# Altium project kea once.PrjPCB
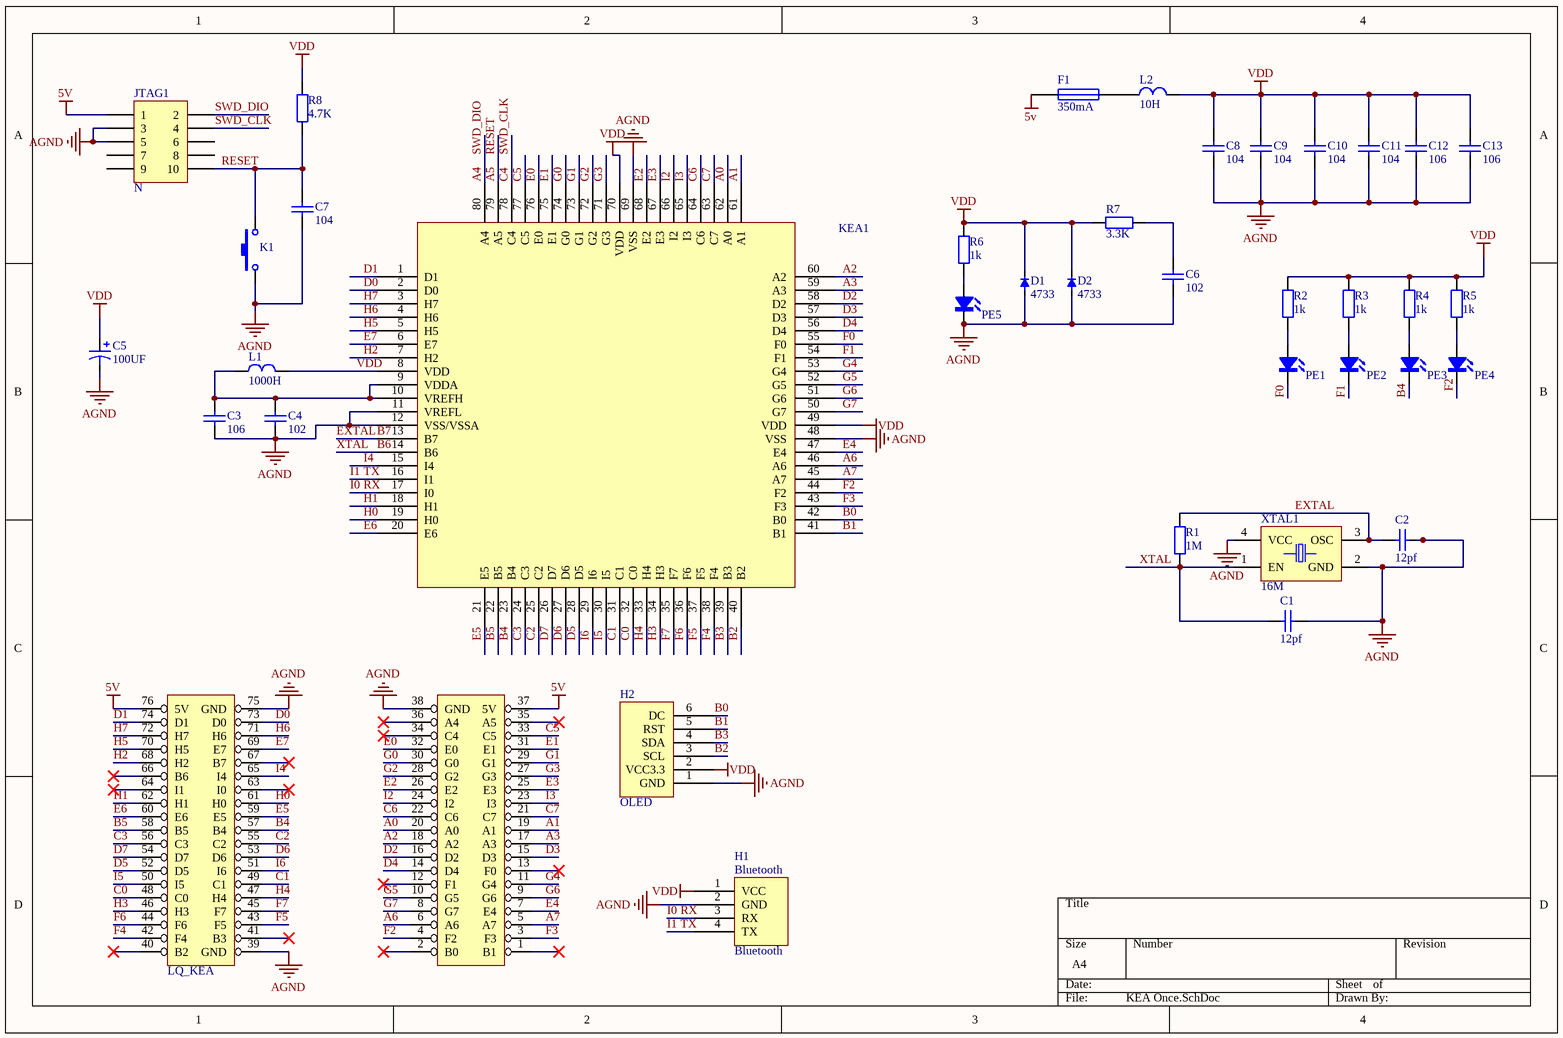
[diagram p0: KEA Once.SchDoc]
1 sheet, 38 parts. Net scope: global (net labels, ports and power ports of the same name join across sheets).
Board file: KEA once.PcbDoc

## Sheet KEA Once.SchDoc
size A4

### Parts
C1  12pf  [0805-0C]
C2  12pf  [0805-0C]
C3  106  [0603]
C4  102  [0805]
C5  100UF  [pol cap(10uF)]
C6  102  [0805]
C7  104  [0603]
C8  104  [0603]
C9  104  [0603]
C10  104  [0603]
C11  104  [0603]
C12  106  [0603]
C13  106  [0603]
D1  4733  [二极管]
D2  4733  [二极管]
F1  350mA  [1206R]
H1  Bluetooth  [S0P4]
H2  OLED  [S0P6]
JTAG1  N  [HDR2X5]
K1  Key  [K_Press]  (value not drawn)
KEA1  kea128芯片  [LQFP80]  (value not drawn)
L1  1000H  [1206C]
L2  10H  [1206C]
LQ_KEA  (no value)  [LQ_KEAP80SYSVK]
PE1  LED  [0805LED1]  (value not drawn)
PE2  LED  [0805LED1]  (value not drawn)
PE3  LED  [0805LED1]  (value not drawn)
PE4  LED  [0805LED1]  (value not drawn)
PE5  LED  [0805LED1]  (value not drawn)
R1  1M  [0603-r]
R2  1k  [0603-r]
R3  1k  [0603-r]
R4  1k  [0603-r]
R5  1k  [0603-r]
R6  1k  [0603-r]
R7  3.3K  [0805]
R8  4.7K  [0603-r]
XTAL1  16M  [LC-SMD-3225_4P]

### Nets
5V: F1.2 JTAG1.1 LQ_KEA.37(5V) LQ_KEA.76(5V)
AGND: C1.2 C2.2 C3.1 C4.1 C5.2 C6.1 C7.1 C8.1 C9.1 C10.1 C11.1 C12.1 C13.1 D1.1(+) D2.1(+) H1.2(GND) H2.1(GND) JTAG1.3 JTAG1.5 K1.1 KEA1.11(VREFL) KEA1.12(VSS/VSSA) KEA1.48(VSS) KEA1.69(VSS) LQ_KEA.38(GND) LQ_KEA.39(GND) LQ_KEA.75(GND) PE5.2(A) XTAL1.2(GND) XTAL1.4(VCC)
VDD: C5.1 C8.2 C9.2 C10.2 C11.2 C12.2 C13.2 D1.2(-) D2.2(-) H1.1(VCC) H2.2(VCC3.3) KEA1.8(VDD) KEA1.49(VDD) KEA1.70(VDD) L1.2 L2.2 R2.2 R3.2 R4.2 R5.2 R6.2 R7.1 R8.2
A0: KEA1.62(A0) LQ_KEA.20(A0)
A1: KEA1.61(A1) LQ_KEA.19(A1)
A2: KEA1.60(A2) LQ_KEA.18(A2)
A3: KEA1.59(A3) LQ_KEA.17(A3)
A4: JTAG1.2 KEA1.80(A4)  [also labelled SWD_DIO]
A5: C7.2 JTAG1.10 K1.2 KEA1.79(A5) R8.1  [also labelled RESET]
A6: KEA1.46(A6) LQ_KEA.6(A6)
A7: KEA1.45(A7) LQ_KEA.5(A7)
B0: H2.6(DC) KEA1.42(B0)
B1: H2.5(RST) KEA1.41(B1)
B2: H2.3(SCL) KEA1.40(B2)
B3: H2.4(SDA) KEA1.39(B3)
B4: KEA1.23(B4) LQ_KEA.57(B4) PE3.2(A)
B5: KEA1.22(B5) LQ_KEA.58(B5)
B6: C1.1 KEA1.14(B6) R1.1 XTAL1.1(EN)  [also labelled XTAL]
B7: C2.1 KEA1.13(B7) R1.2 XTAL1.3(OSC)  [also labelled EXTAL]
C0: KEA1.32(C0) LQ_KEA.48(C0)
C1: KEA1.31(C1) LQ_KEA.49(C1)
C2: KEA1.25(C2) LQ_KEA.55(C2)
C3: KEA1.24(C3) LQ_KEA.56(C3)
C4: JTAG1.4 KEA1.78(C4)  [also labelled SWD_CLK]
C5: KEA1.77(C5) LQ_KEA.33(C5)
C6: KEA1.64(C6) LQ_KEA.22(C6)
C7: KEA1.63(C7) LQ_KEA.21(C7)
D0: KEA1.2(D0) LQ_KEA.73(D0)
D1: KEA1.1(D1) LQ_KEA.74(D1)
D2: KEA1.58(D2) LQ_KEA.16(D2)
D3: KEA1.57(D3) LQ_KEA.15(D3)
D4: KEA1.56(D4) LQ_KEA.14(D4)
D5: KEA1.28(D5) LQ_KEA.52(D5)
D6: KEA1.27(D6) LQ_KEA.53(D6)
D7: KEA1.26(D7) LQ_KEA.54(D7)
E0: KEA1.76(E0) LQ_KEA.32(E0)
E1: KEA1.75(E1) LQ_KEA.31(E1)
E2: KEA1.68(E2) LQ_KEA.26(E2)
E3: KEA1.67(E3) LQ_KEA.25(E3)
E4: KEA1.47(E4) LQ_KEA.7(E4)
E5: KEA1.21(E5) LQ_KEA.59(E5)
E6: KEA1.20(E6) LQ_KEA.60(E6)
E7: KEA1.6(E7) LQ_KEA.69(E7)
F0: KEA1.55(F0) PE1.2(A)
F1: KEA1.54(F1) PE2.2(A)
F2: KEA1.44(F2) LQ_KEA.4(F2) PE4.2(A)
F3: KEA1.43(F3) LQ_KEA.3(F3)
F4: KEA1.38(F4) LQ_KEA.42(F4)
F5: KEA1.37(F5) LQ_KEA.43(F5)
F6: KEA1.36(F6) LQ_KEA.44(F6)
F7: KEA1.35(F7) LQ_KEA.45(F7)
G0: KEA1.74(G0) LQ_KEA.30(G0)
G1: KEA1.73(G1) LQ_KEA.29(G1)
G2: KEA1.72(G2) LQ_KEA.28(G2)
G3: KEA1.71(G3) LQ_KEA.27(G3)
G4: KEA1.53(G4) LQ_KEA.11(G4)
G5: KEA1.52(G5) LQ_KEA.10(G5)
G6: KEA1.51(G6) LQ_KEA.9(G6)
G7: KEA1.50(G7) LQ_KEA.8(G7)
H0: KEA1.19(H0) LQ_KEA.61(H0)
H1: KEA1.18(H1) LQ_KEA.62(H1)
H2: KEA1.7(H2) LQ_KEA.68(H2)
H3: KEA1.34(H3) LQ_KEA.46(H3)
H4: KEA1.33(H4) LQ_KEA.47(H4)
H5: KEA1.5(H5) LQ_KEA.70(H5)
H6: KEA1.4(H6) LQ_KEA.71(H6)
H7: KEA1.3(H7) LQ_KEA.72(H7)
I0: H1.3(RX) KEA1.17(I0)  [also labelled RX]
I1: H1.4(TX) KEA1.16(I1)  [also labelled TX]
I2: KEA1.66(I2) LQ_KEA.24(I2)
I3: KEA1.65(I3) LQ_KEA.23(I3)
I4: KEA1.15(I4) LQ_KEA.65(I4)
I5: KEA1.30(I5) LQ_KEA.50(I5)
I6: KEA1.29(I6) LQ_KEA.51(I6)
NetC3_2: C3.2 C4.2 KEA1.9(VDDA) KEA1.10(VREFH) L1.1
NetC6_2: C6.2 R7.2
NetF1_1: F1.1 L2.1
NetPE1_1: PE1.1(K) R2.1
NetPE2_1: PE2.1(K) R3.1
NetPE3_1: PE3.1(K) R4.1
NetPE4_1: PE4.1(K) R5.1
NetPE5_1: PE5.1(K) R6.1

Not connected (* = marked no-connect by the designer): JTAG1 6 7 8 9; LQ_KEA 1(B1)* 2(B0)* 12(F1)* 13(F0)* 34(C4)* 35(A5)* 36(A4)* 40(B2)* 41(B3)* 63(I0)* 64(I1)* 66(B6)* 67(B7)*

### Notes on the sheet
- (in symbol LQ) http://longqiu.taobao.com/

### Library data of the parts
C1 C2 = CAP
C3 C4 C6-C13 = Cap: 无极电容; Value: 10uF
C5 = pol cap: 通用有极电容; value: 22uF
D1 D2 = IN
F1 = Fuse
JTAG1 = Header 5X2: Header, 5-Pin, Dual row; LatestRevisionDate: 17-Jul-2002; LatestRevisionNote: Re-released for DXP Platform.; Publisher: Altium Limited
K1 = K_Press: 贴片按键
L1 L2 = Inductor
LQ_KEA = LQ: LQ_KEAP80SYSVK
R1-R6 R8 = RES
R7 = Res: 通用电阻; Value: 10K
XTAL1 = XTAL